# EAGLE design LOCO-Sensor (EAGLE 9.6.2)

## Sheet 1 of 2
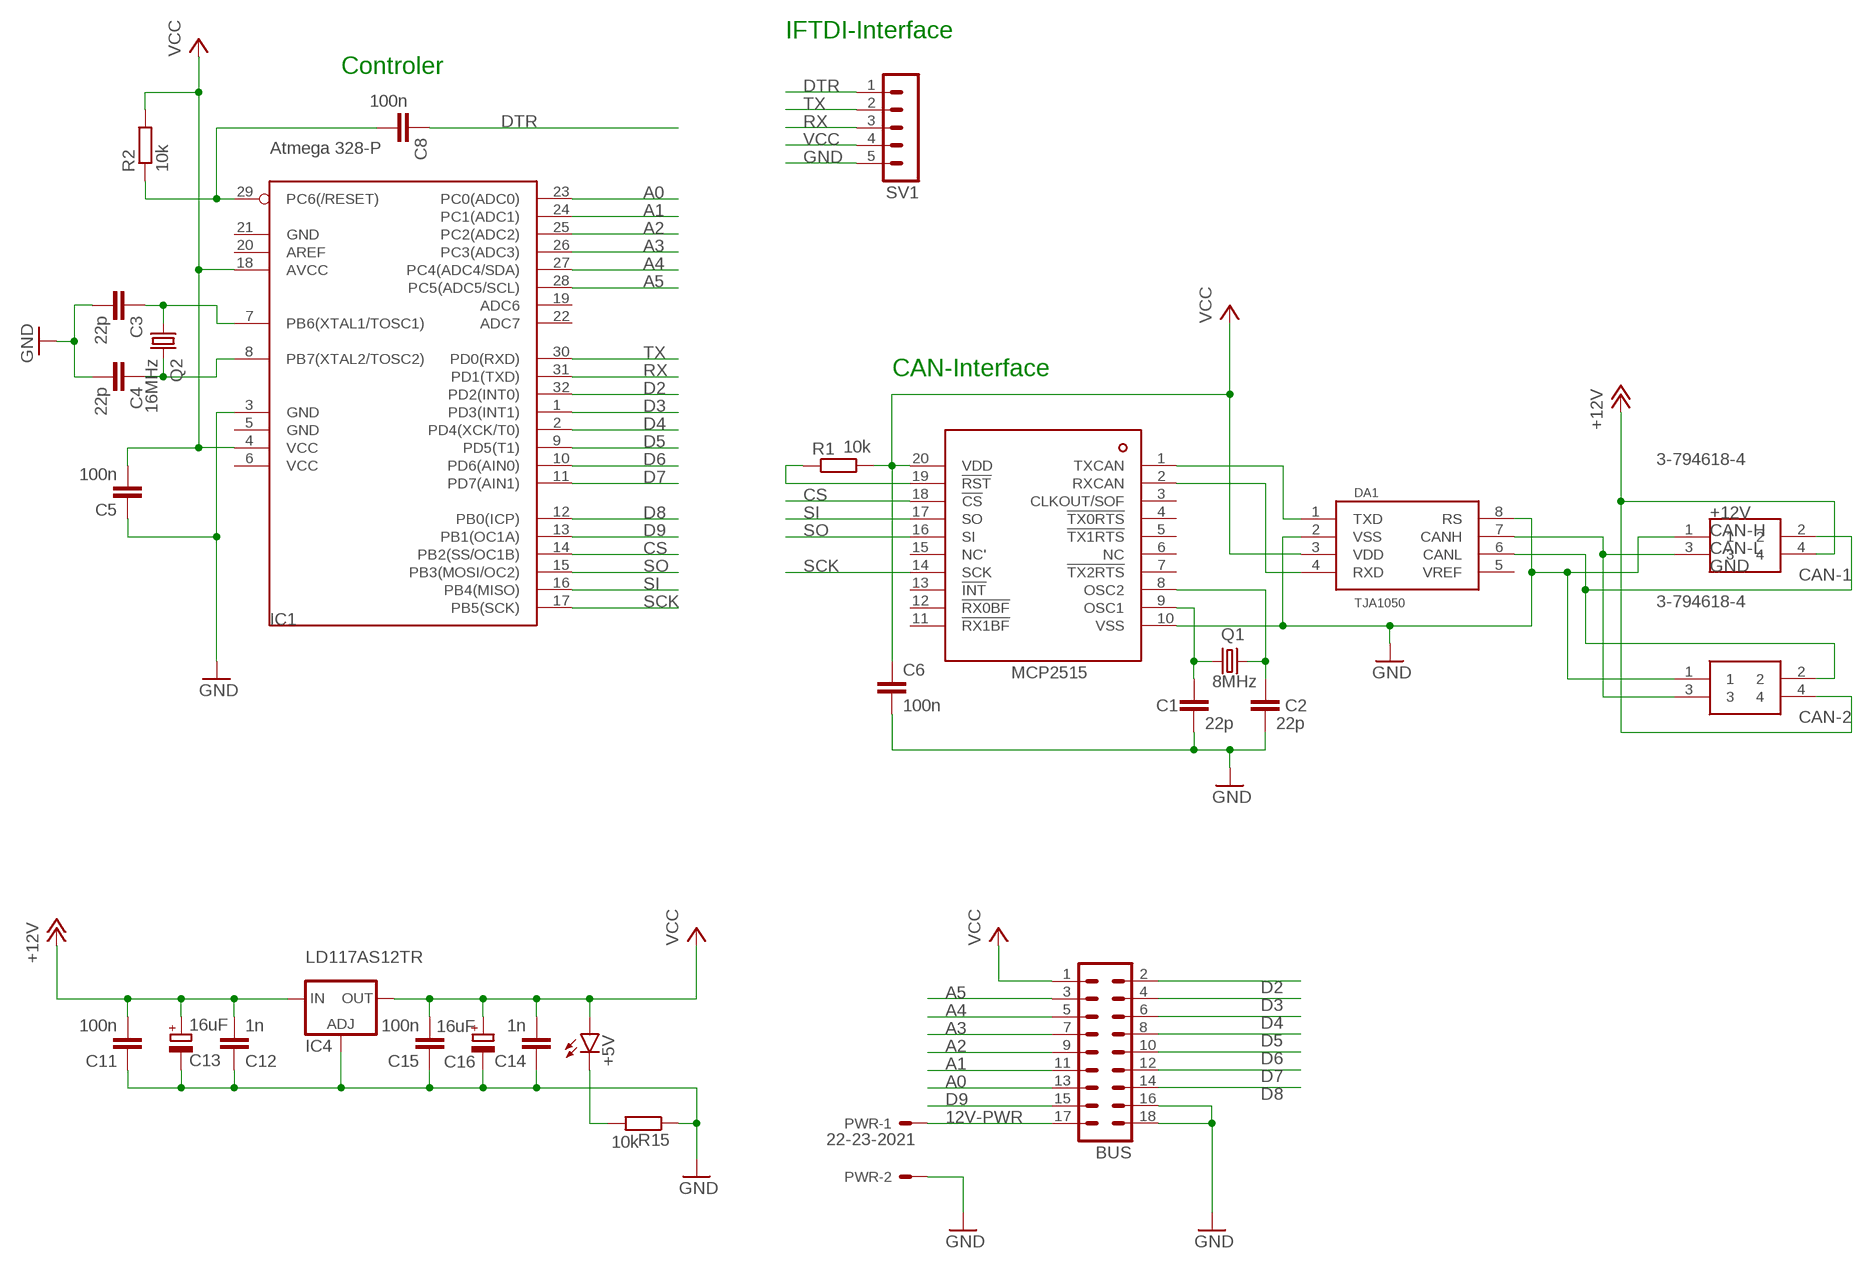
[diagram p0: schematic, sheet 1]

### Parts
+5V  LEDCHIP-LED0603  [CHIP-LED0603]
BUS  MA09-2  [MA09-2]
C1  22p  C-EUC0402K  [C0402K]
C2  22p  C-EUC0402K  [C0402K]
C3  22p  C-EUC0402K  [C0402K]
C4  22p  C-EUC0402K  [C0402K]
C5  100n  C-EUC0402K  [C0402K]
C6  100n  C-EUC0402K  [C0402K]
C8  100n  C-EUC0402K  [C0402K]
C11  100n  C-EUC0402K  [C0402K]
C12  1n  C-EUC0402K  [C0402K]
C13  16uF  CPOL-EUA/3216-18W  [A/3216-18W]
C14  1n  C-EUC0402K  [C0402K]
C15  100n  C-EUC0402K  [C0402K]
C16  16uF  CPOL-EUA/3216-18W  [A/3216-18W]
CAN-1  3-794618-4  [SHDRRA4W102P300_2X2_686X892X73]
CAN-2  3-794618-4  [SHDRRA4W102P300_2X2_686X892X73]
DA1  TJA1050  [SO08]
IC1  Atmega 328-P  MEGA8-AI  [TQFP32-08]
IC2  MCP2515  [TSSOP20]
IC4  LD117AS12TR  [SOT223]
PWR  22-23-2021  [22-23-2021]
Q1  8MHz  CRYSTALHC49S  [HC49/S]
Q2  16MHz  CRYSTALHC49S  [HC49/S]
R1  10k  R-EU_MELF0102W  [MINI_MELF-0102W]
R2  10k  R-EU_MELF0102W  [MINI_MELF-0102W]
R15  10k  R-EU_MELF0102W  [MINI_MELF-0102W]
SV1  MA05-1  [MA05-1]

### Nets
12V-PWR: BUS.17 PWR.1
+12V: C11.2 C12.2 C13.+ CAN-1.4 CAN-2.4 IC4.3(IN)
A0: BUS.13 IC1.23(PC0(ADC0))
A1: BUS.11 IC1.24(PC1(ADC1))
A2: BUS.9 IC1.25(PC2(ADC2))
A3: BUS.7 IC1.26(PC3(ADC3))
A4: BUS.5 IC1.27(PC4(ADC4/SDA))
A5: BUS.3 IC1.28(PC5(ADC5/SCL))
CAN-H: CAN-1.3 CAN-2.3 DA1.7(CANH)
CAN-L: CAN-1.2 CAN-2.2 DA1.6(CANL)
CAN-OCC1: C1.1 IC2.9(OSC1) Q1.1
CAN-OCC2: C2.1 IC2.8(OSC2) Q1.2
CS: IC1.14(PB2(SS/OC1B)) IC2.18(!CS)
D2: BUS.2 IC1.32(PD2(INT0))
D3: BUS.4 IC1.1(PD3(INT1))
D4: BUS.6 IC1.2(PD4(XCK/T0))
D5: BUS.8 IC1.9(PD5(T1))
D6: BUS.10 IC1.10(PD6(AIN0))
D7: BUS.12 IC1.11(PD7(AIN1))
D8: BUS.14 IC1.12(PB0(ICP))
D9: BUS.15 IC1.13(PB1(OC1A))
DTR: C8.1 SV1.1
GND: BUS.16 BUS.18 C1.2 C2.2 C3.2 C4.2 C5.1 C6.2 C11.1 C12.1 C13.- C14.1 C15.1 C16.- CAN-1.1 CAN-2.1 DA1.2(VSS) DA1.8(RS) IC1.3(GND) IC2.10(VSS) IC4.1(ADJ) PWR.2 R15.1 SV1.5
N$6: IC2.19(!RST) R1.1
N$10: C3.1 IC1.7(PB6(XTAL1/TOSC1)) Q2.1
N$11: C4.1 IC1.8(PB7(XTAL2/TOSC2)) Q2.2
N$12: +5V.C R15.2
N$15: C8.2 IC1.29(PC6(/RESET)) R2.1
RX: IC1.31(PD1(TXD)) SV1.3
RXCAN: DA1.4(RXD) IC2.2(RXCAN)
SCK: IC1.17(PB5(SCK)) IC2.14(SCK)
SI: IC1.16(PB4(MISO)) IC2.17(SO)
SO: IC1.15(PB3(MOSI/OC2)) IC2.16(SI)
TX: IC1.30(PD0(RXD)) SV1.2
TXCAN: DA1.1(TXD) IC2.1(TXCAN)
VCC: +5V.A BUS.1 C5.2 C6.1 C14.2 C15.2 C16.+ DA1.3(VDD) IC1.4(VCC) IC1.18(AVCC) IC2.20(VDD) IC4.4(OUT) R1.2 R2.2 SV1.4
Unconnected: DA1.5(VREF) IC1.19(ADC6) IC1.20(AREF) IC1.22(ADC7) IC2.3(CLKOUT/SOF) IC2.4(!TX0RTS) IC2.5(!TX1RTS) IC2.6(NC) IC2.7(!TX2RTS) IC2.11(!RX1BF) IC2.12(!RX0BF) IC2.13(!INT) IC2.15(NC')

### Notes on the sheet
- IFTDI-Interface
- Controler
- CAN-Interface

## Sheet 2 of 2

## Power pins joined to a net without a drawn wire
GND: IC1.5(GND) IC1.21(GND)
VCC: IC1.6(VCC)

## Library data of the parts
+5V = led:LED: LED OSRAM: - CHIPLED LG R971, LG N971, LY N971, LG Q971, LY Q971, LO R971, LY R971 LH N974, LH R974 LS Q976, LO Q976, LY Q976 LO Q996 - Hyper CHIPLED LW Q18S LB Q993, LB Q99A, LB R99A - SideLED LS A670, LO A670, LY A670, LG A670, LP A670 LB A673, LV A673, LT A673, LW A673 LH A674 LY A675 LS A676, LA A676, LO A676, LY A676, LW A676 LS A679, LY A679, LG A679 - Hyper Micro SIDELED® LS Y876, LA Y876, LO Y876, LY Y876 LT Y87S - SmartLED LW L88C, LW L88S LB L89C, LB L89S, LG L890 LS L89K, LO L89K, LY L89K LS L896, LA L896, LO L896, LY L896 - TOPLED LS T670, LO T670, LY T670, LG T670, LP T670 LSG T670, LSP T670, LSY T670, LOP T670, LYG T670 LG T671, LOG T671, LSG T671 LB T673, LV T673, LT T673, LW T673 LH T674 LS T676, LA T676, LO T676, LY T676, LB T676, LH T676, LSB T676, LW T676 LB T67C, LV T67C, LT T67C, LS T67K, LO T67K, LY T67K, LW E67C LS E67B, LA E67B, LO E67B, LY E67B, LB E67C, LV E67C, LT E67C LW T67C LS T679, LY T679, LG T679 LS T770, LO T770, LY T770, LG T770, LP T770 LB T773, LV T773, LT T773, LW T773 LH T774 LS E675, LA E675, LY E675, LS T675 LS T776, LA T776, LO T776, LY T776, LB T776 LHGB T686 LT T68C, LB T68C - Hyper Mini TOPLED® LB M676 - Mini TOPLED Santana® LG M470 LS M47K, LO M47K, LY M47K Source: http://www.osram.convergy.de LUXEON: - LUMILED® LXK2-PW12-R00, LXK2-PW12-S00, LXK2-PW14-U00, LXK2-PW14-V00 LXK2-PM12-R00, LXK2-PM12-S00, LXK2-PM14-U00 LXK2-PE12-Q00, LXK2-PE12-R00, LXK2-PE12-S00, LXK2-PE14-T00, LXK2-PE14-U00 LXK2-PB12-K00, LXK2-PB12-L00, LXK2-PB12-M00, LXK2-PB14-N00, LXK2-PB14-P00, LXK2-PB14-Q00 LXK2-PR12-L00, LXK2-PR12-M00, LXK2-PR14-Q00, LXK2-PR14-R00 LXK2-PD12-Q00, LXK2-PD12-R00, LXK2-PD12-S00 LXK2-PH12-R00, LXK2-PH12-S00 LXK2-PL12-P00, LXK2-PL12-Q00, LXK2-PL12-R00 Source: www.luxeon.com KINGBRIGHT: KA-3528ASYC Source: www.kingbright.com
BUS = con-lstb:MA09-2: PIN HEADER; OC_FARNELL: unknown; OC_NEWARK: unknown
C1-C6 C8 C11 C12 C14 C15 = rcl:C-EU: CAPACITOR, European symbol; SPICEPREFIX: C
C13 C16 = rcl:CPOL-EU: POLARIZED CAPACITOR, European symbol; SPICEPREFIX: C
CAN-1 CAN-2 = SamacSys_Parts:3-794618-4: 4 way 2 row r/a header Mate-N-Lok Source: Datasheet <https://rs.componentsearchengine.com/Datasheets/2/3-794618-4.pdf>; DESCRIPTION: 4 way 2 row r/a header Mate-N-Lok; HEIGHT: 7.37mm; MANUFACTURER_NAME: TE Connectivity; MANUFACTURER_PART_NUMBER: 3-794618-4
DA1 = TJA1050:TJA1050: High speed CAN transceiver Input levels compatible with 3.3 V and 5 V devices 5V supply
IC1 = atmel:MEGA8: MICROCONTROLLER 8 Kbytes FLASH, 1 kbytes SRAM, 512 bytes EEPROM, USART, 6-channel 10 bit ADC, 2-channel 8 bit ADC Pin compatible with Atmega48, ATMega88, ATMega168 Source: avr.lbr; MPN: ATMEGA8-16AU; OC_FARNELL: 9171371; OC_NEWARK: 73M8863
IC2 = mcp2514:MCP2515: Microchip Technology’s MCP2515 is a stand-alone Controller Area Network (CAN) controller that implements the CAN specification, version 2.0B. It is capable of transmitting and receiving both standard and extended data and remote frames. The MCP2515 has two acceptance masks and six acceptance filters that are used to filter out unwanted messages, thereby reducing the host MCUs overhead. The MCP2515 interfaces with microcontrollers (MCUs) via an industry standard Serial Peripheral Interface (SPI).
IC4 = v-reg:LD117A?*: Low drop fixed and adjustable positive voltage regulators 1 A Source: http://www.st.com/stonline/products/literature/ds/7194/ld1117axx.pdf
PWR = con-molex:22-23-2021: .100" (2.54mm) Center Header - 2 Pin; MF: MOLEX; MPN: 22-23-2021; OC_FARNELL: 1462926; OC_NEWARK: 25C3832
Q1 Q2 = crystal:CRYSTAL: CRYSTAL; OC_FARNELL: 1667008; OC_NEWARK: unknown
R1 R2 R15 = rcl:R-EU_: RESISTOR, European symbol; SPICEPREFIX: R
SV1 = con-lstb:MA05-1: PIN HEADER; OC_FARNELL: unknown; OC_NEWARK: unknown

## Board
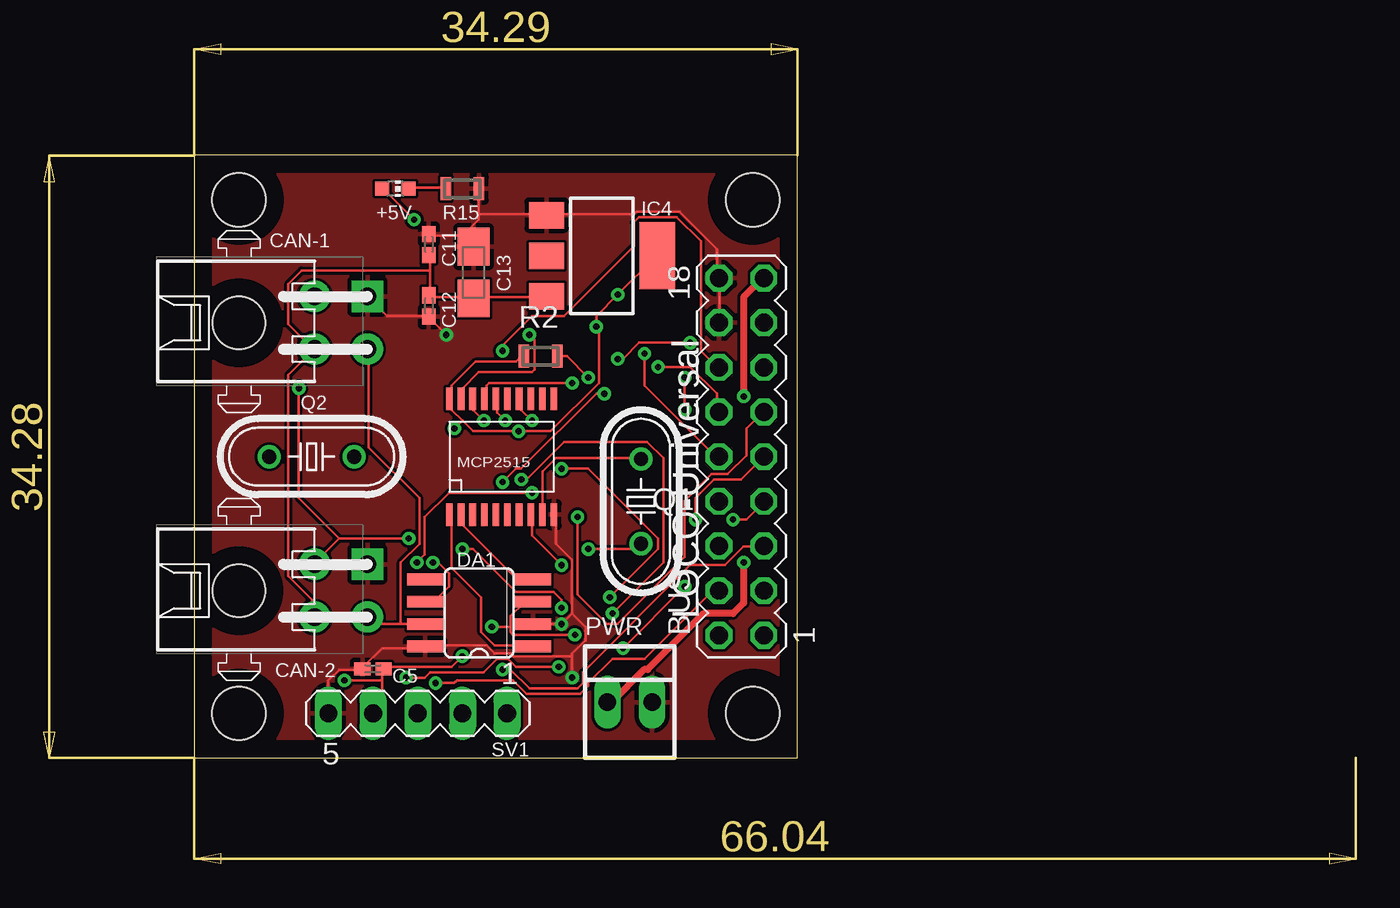
[diagram p1: board, top side]
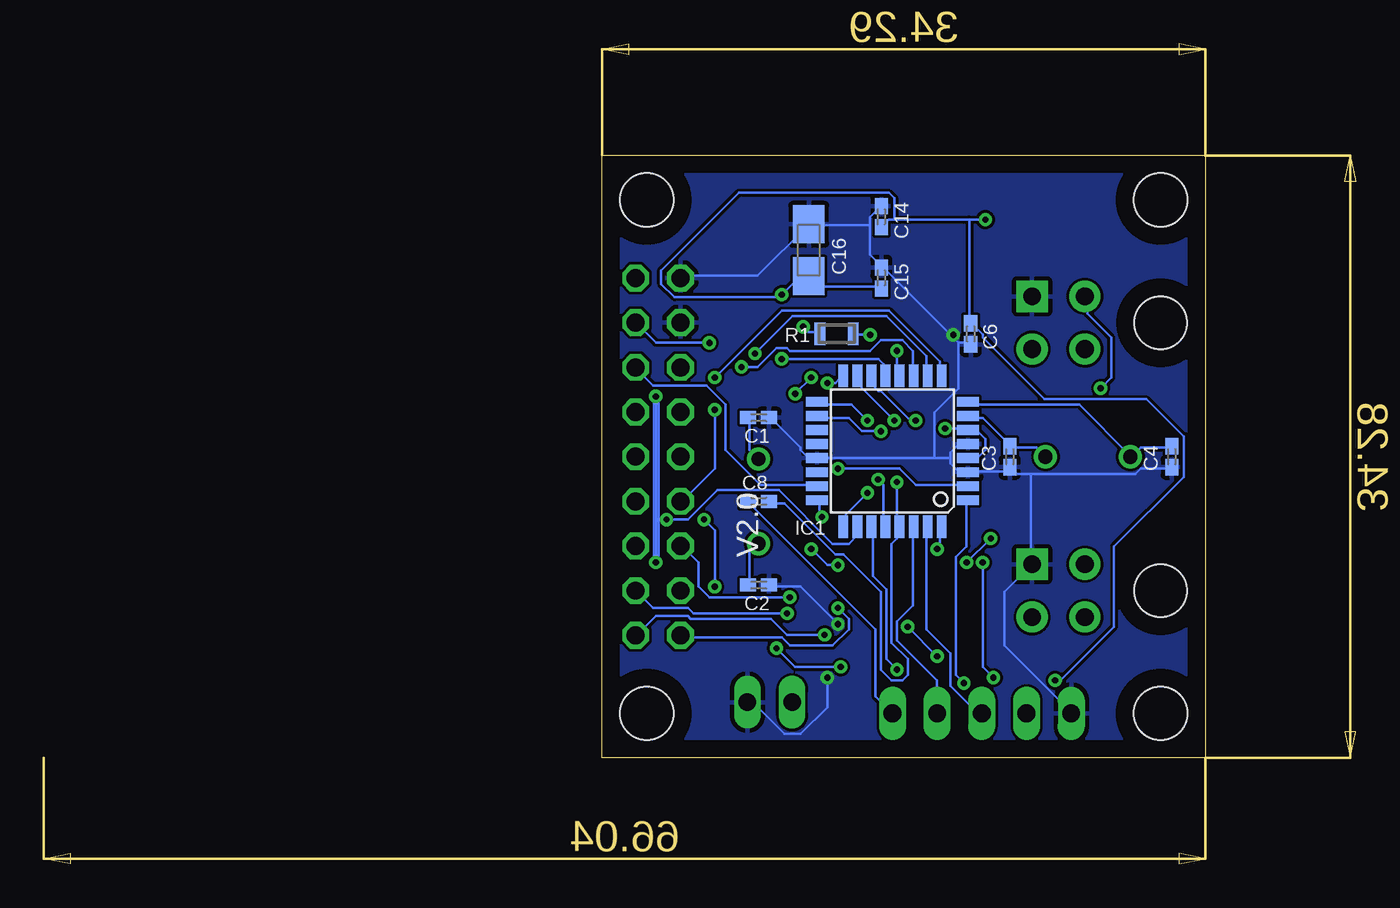
[diagram p2: board, bottom side, seen from below]

Size 34.29 x 34.29 mm. Coordinates in mm from the lower left corner, seen from the top.
Outline: 0,0 34.29,0 34.29,34.29 0,34.29 0,0
Copper layers (1*16): Top 0.035mm / dielectric 1.5mm / Bottom 0.035mm
Design rules "default": minimum track width 6mil, minimum drill 0.35mm, track to track 6mil, track to pad 6mil, pad to pad 6mil, via to via 6mil, smd to smd 6mil, copper to edge 40mil, drill to drill 6mil, minimum pad ring 10mil, minimum via ring 8mil, stop-mask expansion 4mil, vias tented up to drill 0mil, thermal gap 10mil
Holes 3.05 mm at 2.54,2.54 2.54,31.75 31.75,2.54 31.75,31.75

### Footprints (pad centres in the part's own frame; a part is rotated, then mirrored left to right if it is on the bottom)
CHIP-LED0603 = smd 0.8 x 0.8: A 0,-0.75; C 0,0.75
MA09-2 = drill 1.016 octagon: 1 -10.16,-1.27; 2 -10.16,1.27; 3 -7.62,-1.27; 4 -7.62,1.27; 5 -5.08,-1.27; 6 -5.08,1.27; 7 -2.54,-1.27; 8 -2.54,1.27; 9 0,-1.27; 10 0,1.27; 11 2.54,-1.27; 12 2.54,1.27; 13 5.08,-1.27; 14 5.08,1.27; 15 7.62,-1.27; 16 7.62,1.27; 17 10.16,-1.27; 18 10.16,1.27
C0402K = smd 0.925 x 0.74: 1 -0.6,0; 2 0.6,0
A/3216-18W = smd 2.15 x 1.8: + 1.475,0; - -1.475,0
SHDRRA4W102P300_2X2_686X892X73 = drill 1 pad 1.778 square: 1 1.5,-7.3 | drill 1 pad 1.778: 2 1.5,-4.3; 3 -1.5,-7.3; 4 -1.5,-4.3 | hole 3: 0,0
SO08 = smd 0.66 x 2.032: 1 -1.905,-3.073; 2 -0.635,-3.073; 3 0.635,-3.073; 4 1.905,-3.073; 5 1.905,3.073; 6 0.635,3.073; 7 -0.635,3.073; 8 -1.905,3.073
TQFP32-08 = smd 1.27 x 0.559: 1 -4.293,2.8; 2 -4.293,2; 3 -4.293,1.2; 4 -4.293,0.4; 5 -4.293,-0.4; 6 -4.293,-1.2; 7 -4.293,-2; 8 -4.293,-2.8; 17 4.293,-2.8; 18 4.293,-2; 19 4.293,-1.2; 20 4.293,-0.4; 21 4.293,0.4; 22 4.293,1.2; 23 4.293,2; 24 4.293,2.8 | smd 0.559 x 1.27: 9 -2.8,-4.293; 10 -2,-4.293; 11 -1.2,-4.293; 12 -0.4,-4.293; 13 0.4,-4.293; 14 1.2,-4.293; 15 2,-4.293; 16 2.8,-4.293; 25 2.8,4.293; 26 2,4.293; 27 1.2,4.293; 28 0.4,4.293; 29 -0.4,4.293; 30 -1.2,4.293; 31 -2,4.293; 32 -2.8,4.293
TSSOP20 = smd 1.27 x 0.381: 1 -3.302,2.642; 2 -3.302,1.981; 3 -3.302,1.321; 4 -3.302,0.66; 5 -3.302,0; 6 -3.302,-0.66; 7 -3.302,-1.321; 8 -3.302,-1.981; 9 -3.302,-2.642; 10 -3.302,-3.302; 11 3.302,-3.302; 12 3.302,-2.642; 13 3.302,-1.981; 14 3.302,-1.321; 15 3.302,-0.66; 16 3.302,0; 17 3.302,0.66; 18 3.302,1.321; 19 3.302,1.981; 20 3.302,2.642
SOT223 = smd 1.5 x 2: 1 -2.3,-3.15; 2 0,-3.15; 3 2.3,-3.15 | smd 3.8 x 2: 4 0,3.15
22-23-2021 = drill 1 long: 1 -1.27,0; 2 1.27,0
HC49/S = drill 0.813: 1 -2.413,0; 2 2.413,0
MINI_MELF-0102W = smd 0.6 x 1.3: 1 -0.95,0; 2 0.95,0
MA05-1 = drill 1.016 long: 1 -5.08,0; 2 -2.54,0; 3 0,0; 4 2.54,0; 5 5.08,0

### Placement (x,y rotation side)
+5V  11.43,32.38 270 top
BUS  31.11,17.14 90 top
C1  25.4,19.37 0 bottom
C2  25.4,9.84 0 bottom
C3  11.11,17.14 270 bottom
C4  1.91,17.14 270 bottom
C5  10.16,5.08 0 top
C6  13.34,24.13 270 bottom
C8  25.4,14.61 0 bottom
C11  13.34,29.21 270 top
C12  13.34,25.72 90 top
C13  15.88,27.62 270 top
C14  18.41,30.8 270 bottom
C15  18.41,27.3 270 bottom
C16  22.54,28.89 270 bottom
CAN-1  2.54,24.77 90 top
CAN-2  2.54,9.53 90 top
DA1  16.19,8.26 90 top
IC1  17.78,17.46 180 bottom
IC2  17.14,17.14 90 top
IC4  23.18,28.57 270 top
PWR  24.77,3.17 0 top
Q1  25.4,14.61 270 top
Q2  6.67,17.14 180 top
R1  20.95,24.13 180 bottom
R2  19.68,22.86 180 top
R15  15.24,32.38 180 top
SV1  12.7,2.54 180 top

### Tracks (layer width: path | path; a pad name or v marks a point on that pad's centre or on a via)
12V-PWR  (via drill 0.35)
  Top 0.406: v31.24,11.12 31.24,8.81 30.64,8.22 28.96,8.22 25.78,5.04 25.57,5.04 23.71,3.17 PWR.1 | v31.24,20.57 31.24,26.21 32.31,27.28 BUS.17
  Bottom 0.406: v31.24,20.57 v31.24,11.12
+12V
  Top 0.152: 13.41,27.74 13.41,28.5 C11.2 | 13.41,27.74 13.41,26.36 C12.2 13.41,26.21 15.85,26.21 C13.+ 16,26.21 19.96,26.21 IC4.3 | 13.41,27.74 6.1,27.74 5.33,26.98 5.33,24.69 6.71,23.32 CAN-1.4 6.71,23.16 5.33,21.79 5.33,10.36 6.71,8.99 6.71,8.08 CAN-2.4
A0
  Bottom 0.152: IC1.23 22.1,15.54 25.3,15.54 27.28,17.53 27.28,20.12 28.35,21.18 31.39,21.18 32.31,22.1 BUS.13
A1  (via drill 0.35)
  Top 0.152: v21.79,13.72 21.79,9.3 23.47,7.62 24.08,7.62 27.89,11.43 27.89,14.63 29.41,16.15 30.33,16.15 31.39,17.22 31.39,18.75 32.31,19.66 BUS.11
  Bottom 0.152: v21.79,13.72 21.95,13.87 21.95,14.63 IC1.24
A2  (via drill 0.35)
  Top 0.152: v19.2,15.09 14.48,15.09 13.11,13.72 13.11,11.58 v12.65,11.12 | v12.04,4.57 13.11,4.57 13.41,4.88 16.46,4.88 17.22,5.64 17.83,5.64 18.29,5.18 v20.73,5.18 | v27.89,9.75 v24.38,6.25 | v28.5,13.56 28.5,14.78 29.57,15.85 31.09,15.85 BUS.9
  Bottom 0.152: v19.2,15.09 20.57,13.72 20.57,13.26 IC1.25 | v12.65,11.12 12.65,5.18 v12.04,4.57 | v20.73,5.18 23.32,5.18 v24.38,6.25 | v27.89,9.75 27.89,12.95 v28.5,13.56
A3  (via drill 0.35)
  Top 0.152: v30.63,13.56 31.39,13.56 32.31,14.48 BUS.7
  Bottom 0.152: v30.63,13.56 29.41,13.56 27.74,15.24 24.23,15.24 21.18,12.19 20.27,12.19 19.81,12.65 19.81,13.11 IC1.26
A4  (via drill 0.35)
  Top 0.152: v17.53,5.03 17.98,5.03 19.05,3.96 21.79,3.96 22.1,4.27 22.1,4.88 28.19,10.97 30.18,10.97 31.24,12.04 32.31,12.04 BUS.5
  Bottom 0.152: v17.53,5.03 18.14,5.64 18.14,9.6 18.9,10.36 18.9,13.11 IC1.27
A5  (via drill 0.35)
  Top 0.152: v18.59,15.85 18.9,15.85 21.03,17.98 25.76,17.98 26.67,17.07 26.67,11.12 v23.77,8.23
  Bottom 0.152: v18.59,15.85 18.29,15.54 18.29,13.26 IC1.28 | v23.77,8.23 29.11,8.23 29.41,8.53 31.39,8.53 BUS.3
CAN-H
  Top 0.152: 11.73,7.62 10.21,7.62 9.91,7.92 CAN-2.3 | 11.73,7.62 DA1.7 | 11.73,7.62 11.73,11.12 12.8,12.19 12.8,14.78 9.91,17.68 9.91,23.16 CAN-1.3
CAN-L  (via drill 0.35)
  Top 0.152: v13.56,11.12 13.87,11.12 14.48,10.52 14.48,9.75 13.72,8.99 13.26,8.99 DA1.6 | 8.23,12.5 v12.19,12.5 | 8.23,12.5 6.86,11.12 CAN-2.2 | v5.94,21.03 5.94,14.78 8.23,12.5
  Bottom 0.152: v12.19,12.5 v13.56,11.12 | v5.94,21.03 5.33,21.64 5.33,23.93 6.71,25.3 6.71,26.21 CAN-1.2
CAN-OCC1
  Top 0.152: IC2.9 19.81,13.87 19.81,16.31 20.57,17.07 25.3,17.07 Q1.1
  Bottom 0.152: Q1.1 25.91,17.53 25.91,19.36 C1.1
CAN-OCC2  (via drill 0.35)
  Top 0.152: v20.88,10.97 19.2,12.65 19.2,13.72 IC2.8 | v22.4,11.89 24.99,11.89 25.3,12.19 Q1.2
  Bottom 0.152: C2.1 25.91,9.91 25.91,11.73 25.45,12.19 Q1.2 | v20.88,10.97 21.49,10.97 v22.4,11.89
CS  (via drill 0.35)
  Top 0.152: v16.46,19.2 15.85,19.81 15.85,20.42 IC2.18
  Bottom 0.152: v16.46,19.2 16.76,19.2 18.44,20.88 18.59,20.88 18.9,21.18 18.9,21.64 IC1.14
D2  (via drill 0.35)
  Top 0.152: v15.24,11.89 15.85,11.89 18.29,9.45 20.42,9.45 20.88,8.99 v20.88,8.53
  Bottom 0.152: v15.24,11.89 15.09,12.04 15.09,13.11 IC1.32 | v20.88,8.53 20.27,7.92 20.27,7.32 21.18,6.4 23.62,6.4 24.08,6.86 29.72,6.86 BUS.2
D3  (via drill 0.35)
  Top 0.152: v13.72,4.27 14.78,4.27 14.94,4.42 18.14,4.42 18.9,3.66 21.95,3.66 22.4,4.12 22.4,4.27 23.77,5.64 25.6,5.64 29.41,9.45 29.72,9.45 BUS.4
  Bottom 0.152: v13.72,4.27 14.17,4.72 14.17,11.43 13.56,12.04 13.56,14.63 IC1.1
D4  (via drill 0.35)
  Top 0.152: v20.88,16.46 22.4,16.46 26.36,12.5 26.36,11.89 v23.62,9.14
  Bottom 0.152: v20.88,16.46 17.37,16.46 16.46,15.54 13.56,15.54 IC1.2 | v23.62,9.14 28.19,9.14 28.8,9.75 28.8,11.12 29.72,12.04 BUS.6
D5  (via drill 0.35)
  Top 0.152: v27.89,19.81 v27.89,21.64
  Bottom 0.152: v27.89,21.64 24.08,25.45 17.98,25.45 15.09,22.55 15.09,21.79 IC1.9 | v27.89,19.81 27.89,16.46 29.72,14.63 BUS.8
D6  (via drill 0.35)
  Top 0.152: v25.6,23.01 25.6,21.18 29.72,17.07 BUS.10
  Bottom 0.152: v25.6,23.01 23.47,25.15 18.14,25.15 15.85,22.86 15.85,21.79 IC1.10
D7  (via drill 0.35)
  Top 0.152: v26.36,22.25 28.19,22.25 29.72,20.73 29.72,19.81 BUS.12
  Bottom 0.152: v26.36,22.25 25.45,22.25 24.38,23.32 23.77,23.32 23.62,23.16 19.05,23.16 18.44,23.77 17.22,23.77 16.61,23.16 16.61,21.79 IC1.11
D8  (via drill 0.35)
  Top 0.152: v17.53,23.16 17.53,23.47 19.2,25.15 21.03,25.15 24.99,29.11 24.99,30.48 25.3,30.79 27.43,30.79 28.8,29.41 28.8,23.16 29.72,22.25 BUS.14
  Bottom 0.152: v17.53,23.16 17.53,21.79 IC1.12
D9  (via drill 0.35)
  Top 0.152: v24.08,22.71 24.38,22.71 25.3,23.62 v28.19,23.62
  Bottom 0.152: v24.08,22.71 18.59,22.71 18.29,22.4 18.29,21.79 IC1.13 | v28.19,23.62 31.24,23.62 BUS.15
DTR
  Bottom 0.152: SV1.1 18.75,3.5 18.75,7.32 25.91,14.48 C8.1
GND  (via drill 0.35)
  Top 0.152: SV1.5 7.62,4.42 8.23,5.03 9.45,5.03 C5.1 9.6,5.18 10.67,6.25 13.11,6.25 DA1.8 13.26,6.4 16.61,6.4 17.07,5.94 17.98,5.94 18.14,5.79 21.49,5.79 | DA1.2 v20.88,7.62 21.49,8.23 | 21.49,8.23 21.49,11.28 20.57,12.19 20.57,13.72 IC2.10 | 21.49,5.79 21.49,5.94 22.25,6.71 22.25,7.47 21.49,8.23 | 21.49,5.79 v21.49,4.57 | CAN-1.1 9.91,26.21 10.97,25.15 13.26,25.15 C12.1 13.41,24.99 v14.33,24.08 | 15.24,29.72 13.41,29.72 C11.1 | 15.24,29.72 15.85,29.11 C13.- 15.24,29.72 | 16.15,30.94 16.15,30.63 15.24,29.72 | 16.15,30.94 16.15,32.31 R15.1 | 16.15,30.94 19.96,30.94 IC4.1 20.12,30.94 24.99,30.94 25.15,31.09 27.58,31.09 29.72,28.96 29.72,27.43 BUS.18 29.87,27.28 29.87,24.84 BUS.16
  Bottom 0.152: v20.88,7.62 23.01,9.75 24.69,9.75 C2.2 | v21.49,4.57 21.49,2.9 23.01,1.37 23.93,1.37 25.6,3.05 25.91,3.05 PWR.2 | 14.02,23.62 13.41,23.62 C6.2 | 14.48,24.08 18.29,27.89 C15.1 18.44,28.04 19.05,28.65 19.05,30.33 | 14.48,24.08 14.02,23.62 | 19.05,30.33 19.05,30.79 18.44,31.39 C14.1 | 19.05,30.33 22.4,30.33 C16.- 22.55,30.33 25.45,27.43 29.72,27.43 BUS.18 | 14.48,24.08 v14.33,24.08 | C1.2 24.69,19.36 23.01,17.68 23.01,17.53 22.55,17.07 22.1,17.07 IC1.21 21.95,17.07 15.39,17.07 | 9.91,16.15 10.67,16.15 10.97,16.46 C3.2 11.12,16.46 11.28,16.31 13.41,16.31 IC1.3 13.56,16.31 14.02,16.31 14.48,16.76 14.48,17.07 | 9.91,16.15 3.96,16.15 3.66,16.46 1.98,16.46 C4.2 | 14.48,17.07 14.48,17.37 14.02,17.83 13.56,17.83 IC1.5 | 14.48,17.07 15.39,17.07 | 9.91,16.15 9.91,11.12 CAN-2.1 9.91,10.97 11.43,9.45 11.43,6.4 7.62,2.59 SV1.5 | 14.02,23.62 14.02,21.03 15.39,19.66 15.39,17.07
  pour Top: 0,34.29 34.29,34.29 34.29,0 0,0
  pour Bottom: 0,34.29 34.29,34.29 34.29,0 0,0
N$6  (via drill 0.35)
  Top 0.152: v19.05,24.08 19.36,23.77 19.36,22.1 19.2,21.95 16.15,21.95 15.24,21.03 15.24,20.57 IC2.19
  Bottom 0.152: v19.05,24.08 19.96,24.08 R1.1
N$10
  Bottom 0.152: Q2.1 9.14,17.22 9.6,17.68 10.97,17.68 C3.1 11.12,17.83 12.65,19.36 13.41,19.36 IC1.7
N$11
  Bottom 0.152: C4.1 1.98,17.68 3.66,17.68 4.12,17.22 Q2.2 4.27,17.22 7.16,20.12 13.41,20.12 IC1.8
N$12
  Top 0.152: +5V.C 12.19,32.46 14.17,32.46 R15.2
N$15  (via drill 0.35)
  Top 0.152: R2.1 21.18,22.86 v22.4,21.64 | v23.32,20.73 22.86,20.73 18.59,16.46 18.29,16.46 v17.53,15.7
  Bottom 0.152: C8.2 24.69,14.48 23.93,14.48 21.03,11.58 20.57,11.58 18.44,9.45 18.44,5.03 17.83,4.42 17.22,4.42 16.92,4.72 16.92,5.64 17.83,6.55 17.83,12.19 17.53,12.5 17.53,13.11 IC1.29 17.53,13.26 v17.53,15.7 | v23.32,20.73 v22.4,21.64
RX
  Bottom 0.152: IC1.31 15.85,13.11 15.85,7.32 14.48,5.94 14.48,4.12 12.8,2.44 SV1.3
RXCAN
  Top 0.152: IC2.2 15.24,13.72 15.24,13.26 18.29,10.21 19.2,10.21 DA1.4
SCK  (via drill 0.35)
  Top 0.152: v19.2,19.2 18.59,19.81 18.59,20.42 IC2.14
  Bottom 0.152: v19.2,19.2 20.12,20.12 21.95,20.12 IC1.17
SI  (via drill 0.35)
  Top 0.152: v21.49,21.34 16.76,21.34 16.61,21.18 16.61,20.57 IC2.17
  Bottom 0.152: v21.49,21.34 21.03,21.34 20.73,21.64 IC1.16
SO  (via drill 0.35)
  Top 0.152: v17.68,19.2 17.22,19.66 17.22,20.42 IC2.16
  Bottom 0.152: v17.68,19.2 19.66,21.18 19.66,21.64 IC1.15
TX
  Bottom 0.152: SV1.2 15.24,4.42 17.53,6.71 17.53,7.77 16.61,8.69 16.61,13.11 IC1.30
TXCAN
  Top 0.152: IC2.1 14.63,13.72 14.63,10.82 16.31,9.14 16.31,7.16 17.07,6.4 19.2,6.4 DA1.1
VCC  (via drill 0.35)
  Top 0.152: 10.67,4.42 10.67,3.05 SV1.4 | 10.67,4.42 10.67,5.03 C5.2 10.82,5.18 14.63,5.18 v15.24,5.79 | 17.98,7.47 17.98,7.16 18.14,7.01 v21.64,7.01 | 17.98,7.47 17.98,8.08 18.75,8.84 19.2,8.84 DA1.3 | 17.98,7.47 v16.92,7.47 | R2.2 18.59,22.86 18.29,22.55 16,22.55 14.63,21.18 14.63,20.57 IC2.20 14.63,20.42 14.63,19.81 15.24,19.2 | 15.24,19.2 15.85,18.59 v18.44,18.59 20.27,18.59 23.01,21.34 23.01,24.38 v22.86,24.54 22.86,25.15 v24.08,26.36 26.21,28.5 IC4.4 | 15.24,19.2 v14.78,18.75 | v12.5,30.63 10.82,32.31 +5V.A | v8.53,4.42 10.67,4.42
  Bottom 0.152: v21.64,7.01 23.77,7.01 24.69,7.92 29.26,7.92 29.41,8.08 31.24,8.08 32.31,7.01 BUS.1 | v16.92,7.47 v15.24,5.79 | IC1.4 13.41,17.07 12.95,17.07 12.5,17.53 12.5,18.14 12.95,18.59 13.41,18.59 IC1.6 13.56,18.75 v14.78,18.75 | v18.44,18.59 19.51,18.59 20.27,19.36 21.95,19.36 IC1.18 | 17.68,30.63 17.98,30.63 18.29,30.33 C14.2 | 17.68,30.63 13.41,30.63 | 13.41,30.63 v12.5,30.63 | 13.41,30.63 13.41,24.84 C6.1 13.26,24.69 12.65,24.08 12.65,23.93 9.14,20.42 3.35,20.42 1.22,18.29 1.22,16 5.18,12.04 5.18,7.47 8.23,4.42 v8.53,4.42 | C15.2 18.44,26.82 21.95,26.82 22.4,27.28 C16.+ 22.55,27.28 23.16,27.28 v24.08,26.36 24.23,26.21 30.18,26.21 30.94,26.98 30.94,27.74 26.52,32.16 17.98,32.16 17.68,31.85 17.68,30.63 | v22.86,24.54 22.55,24.23 21.95,24.23 R1.2

### Text on the board
tNames: LOCO-Universal
bNames: V2.0